# EAGLE design power (EAGLE 8.3.1)
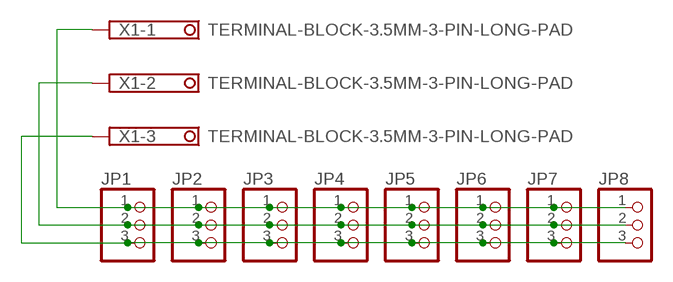
[diagram p0: schematic, sheet 1]

## Parts
JP1  PINHD-1X3/90  [1X03/90]
JP2  PINHD-1X3/90  [1X03/90]
JP3  PINHD-1X3/90  [1X03/90]
JP4  PINHD-1X3/90  [1X03/90]
JP5  PINHD-1X3/90  [1X03/90]
JP6  PINHD-1X3/90  [1X03/90]
JP7  PINHD-1X3/90  [1X03/90]
JP8  PINHD-1X3/90  [1X03/90]
X1  TERMINAL-BLOCK-3.5MM-3-PIN-LONG-PAD  [TERMINAL-BLOCK-3-PIN-3.5MM-LONG-PAD]

## Nets
N$1: JP1.1 JP2.1 JP3.1 JP4.1 JP5.1 JP6.1 JP7.1 JP8.1 X1.1
N$2: JP1.2 JP2.2 JP3.2 JP4.2 JP5.2 JP6.2 JP7.2 JP8.2 X1.2
N$3: JP1.3 JP2.3 JP3.3 JP4.3 JP5.3 JP6.3 JP7.3 JP8.3 X1.3

## Library data of the parts
JP1-JP8 = pinhead:PINHD-1X3: PIN HEADER
X1 = terminalBlock3-5mmv1-0:TERMINAL-BLOCK-3.5MM-3-PIN: Terminal Block 3.5mm Pitch: 3,5 mm Number of pins: 3 Created by Rembrandt Electronics www.rembrandtelectronics.com

## Board
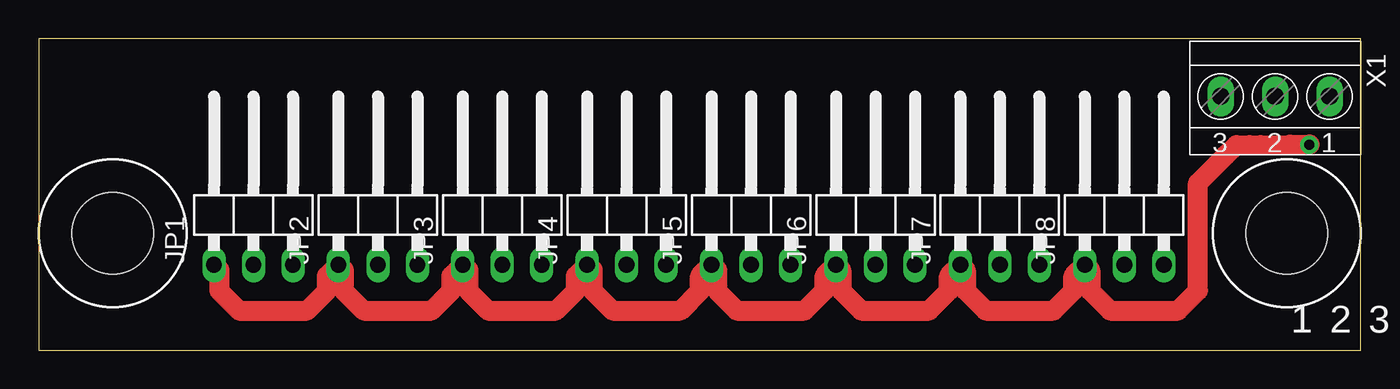
[diagram p1: board, top side]
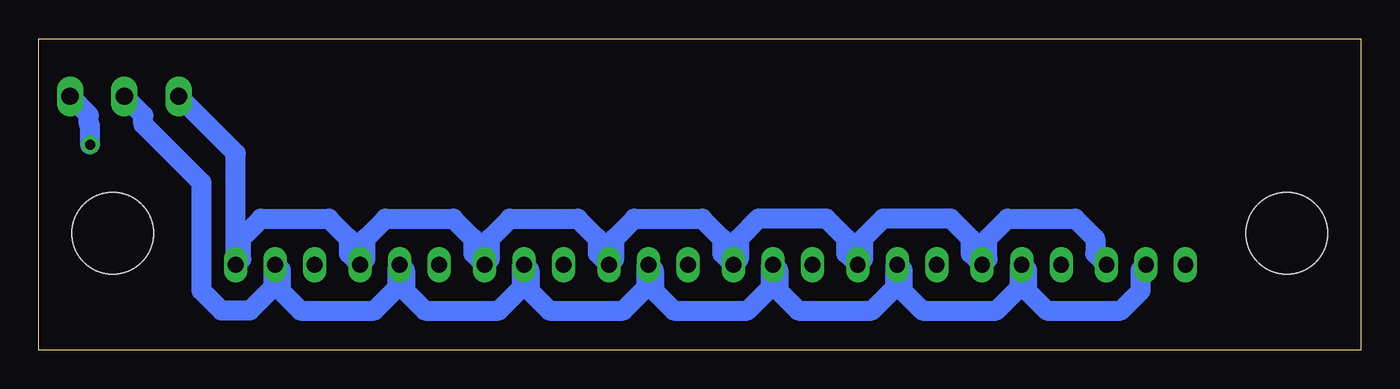
[diagram p2: board, bottom side, seen from below]

Size 85 x 20 mm. Coordinates in mm from the lower left corner, seen from the top.
Outline: 0,0 85,0 85,20 0,20 0,0
Copper layers (1*16): Top 0.035mm / dielectric 1.5mm / Bottom 0.035mm
Design rules "OthermillDRC_1_32_v2": minimum track width 8mil, minimum drill 0.8mm, track to track 0.794003125mm, track to pad 0.794003125mm, pad to pad 0.794003125mm, via to via 0.794003125mm, smd to smd 0mil, copper to edge 0mil, drill to drill 1mil, minimum pad ring 10mil, minimum via ring 10mil, stop-mask expansion 1mil, vias tented up to drill 30mil, thermal gap 10mil
Holes 5.25 mm at 4.75,7.5 80.25,7.5

### Footprints (pad centres in the part's own frame; a part is rotated, then mirrored left to right if it is on the bottom)
1X03/90 = drill 1.016 long: 1 -2.54,-3.81; 2 0,-3.81; 3 2.54,-3.81
TERMINAL-BLOCK-3-PIN-3.5MM-LONG-PAD = drill 1.1 pad 1.7 long: 1 -3.5,-0.1; 2 0,-0.1; 3 3.5,-0.1

### Placement (x,y rotation side)
JP1  13.8,9.3 0 top
JP2  21.8,9.3 0 top
JP3  29.8,9.3 0 top
JP4  37.8,9.3 0 top
JP5  45.8,9.3 0 top
JP6  53.8,9.3 0 top
JP7  61.8,9.3 0 top
JP8  69.8,9.3 0 top
X1  79.5,16.2 180 top

### Tracks (layer width: path | path; a pad name or v marks a point on that pad's centre or on a via)
N$1  (via drill 0.65)
  Top 1.27: JP1.1 11.61,5.14 11.61,3.82 12.89,2.54 17.25,2.54 18.53,3.82 18.53,4.76 JP2.1 19.61,5.14 19.61,3.82 20.89,2.54 25.25,2.54 26.53,3.82 26.53,4.76 JP3.1 27.61,5.14 27.61,3.82 28.89,2.54 33.25,2.54 34.53,3.82 34.53,4.76 JP4.1 35.61,5.14 35.61,3.82 36.89,2.54 41.25,2.54 42.53,3.82 42.53,4.76 JP5.1 43.61,5.14 43.61,3.82 44.89,2.54 49.25,2.54 50.53,3.82 50.53,4.76 JP6.1 51.61,5.14 51.61,3.82 52.89,2.54 57.25,2.54 58.53,3.82 58.53,4.76 JP7.1 59.61,5.14 59.61,3.82 60.89,2.54 65.25,2.54 66.53,3.82 66.53,4.76 JP8.1 67.61,5.14 67.61,3.82 68.89,2.54 73.25,2.54 74.53,3.82 74.53,10.73 76.3,12.5 76.3,12.53 77.04,13.16 77.86,13.16 78.56,13.17 80.44,13.17 80.47,13.2 v81.7,13.2
  Bottom 1.27: v81.7,13.2 81.7,14.43 81.78,14.51 81.78,15.08 X1.1
N$2
  Bottom 1.27: JP1.2 14.15,5.14 14.15,3.82 15.43,2.54 20.17,2.54 21.45,3.82 21.45,5.14 JP2.2 21.93,5.36 21.93,4.04 23.43,2.54 28.17,2.54 29.45,3.82 29.45,5.14 JP3.2 29.93,5.36 29.93,4.04 31.43,2.54 36.17,2.54 37.45,3.82 37.45,5.14 JP4.2 37.93,5.36 37.93,4.04 39.43,2.54 44.17,2.54 45.45,3.82 45.45,5.14 JP5.2 45.93,5.36 45.93,4.04 47.43,2.54 52.17,2.54 53.45,3.82 53.45,5.14 JP6.2 53.93,5.36 53.93,4.04 55.43,2.54 60.17,2.54 61.45,3.82 61.45,5.14 JP7.2 61.93,5.36 61.93,4.04 63.43,2.54 68.17,2.54 69.45,3.82 69.45,5.14 JP8.2 69.93,5.36 69.93,4.04 71.43,2.54 73.25,2.54 74.53,3.82 74.53,10.76 78.28,14.51 78.28,15.08 X1.2
N$3
  Bottom 1.27: JP1.3 17.07,6.22 17.07,7.16 18.35,8.44 22.71,8.44 23.99,7.16 23.99,5.84 JP2.3 25.07,6.22 25.07,7.16 26.35,8.44 30.71,8.44 31.99,7.16 31.99,5.84 JP3.3 33.07,6.22 33.07,7.16 34.35,8.44 38.71,8.44 39.99,7.16 39.99,5.84 JP4.3 41.07,6.22 41.07,7.16 42.35,8.44 46.71,8.44 47.99,7.16 47.99,5.84 JP5.3 49.07,6.22 49.07,7.16 50.35,8.44 54.71,8.44 55.99,7.16 55.99,5.84 JP6.3 57.07,6.22 57.07,7.16 58.35,8.44 62.71,8.44 63.99,7.16 63.99,5.84 JP7.3 65.07,6.22 65.07,7.16 66.35,8.44 70.71,8.44 71.99,7.16 71.99,5.84 JP8.3 72.34,12.64 X1.3

### Text on the board
tPlace: 1 | 2 | 3